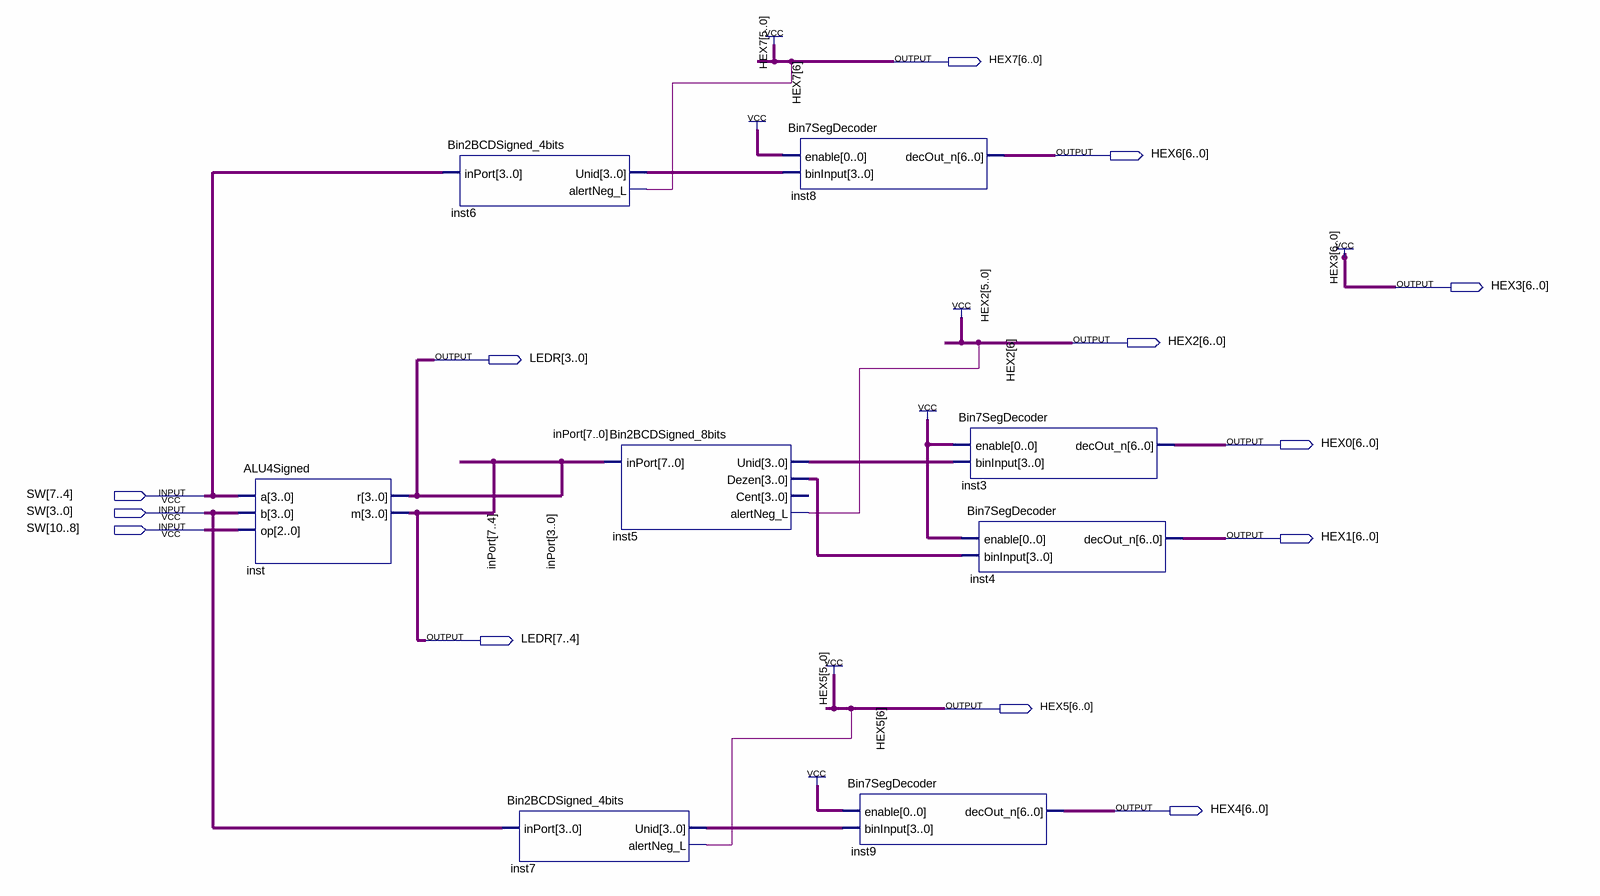
[diagram p0: schematic sheet]
// Quartus schematic ALUDemoSigned.bdf as structural Verilog: 8 symbols, 13 pins
module ALUDemoSigned (
  input  [10:0] SW,
  output [6:0] HEX7,
  output [6:0] HEX6,
  output [6:0] HEX3,
  output [6:0] HEX2,
  output [7:0] LEDR,
  output [6:0] HEX0,
  output [6:0] HEX1,
  output [6:0] HEX5,
  output [6:0] HEX4
);

  wire [3:0] inst5_dezen, inst5_unid, inst6_unid, inst7_unid;

  ALU4Signed inst (.a(SW[7:4]), .b(SW[3:0]), .op(SW[10:8]), .r(LEDR[3:0]), .m(LEDR[7:4]));
  Bin2BCDSigned_4bits inst6 (.inPort(SW[7:4]), .Unid(inst6_unid), .alertNeg_L(HEX7[6]));
  Bin2BCDSigned_4bits inst7 (.inPort(SW[3:0]), .Unid(inst7_unid), .alertNeg_L(HEX5[6]));
  Bin2BCDSigned_8bits inst5 (
    .inPort(LEDR), .Unid(inst5_unid), .Dezen(inst5_dezen), .alertNeg_L(HEX2[6]));  // open: Cent
  Bin7SegDecoder inst8 (.enable(1'b1), .binInput(inst6_unid), .decOut_n(HEX6));
  Bin7SegDecoder inst9 (.enable(1'b1), .binInput(inst7_unid), .decOut_n(HEX4));
  Bin7SegDecoder inst3 (.enable(1'b1), .binInput(inst5_unid), .decOut_n(HEX0));
  Bin7SegDecoder inst4 (.enable(1'b1), .binInput(inst5_dezen), .decOut_n(HEX1));

  assign HEX2[5:0] = {6{1'b1}};
  assign HEX3 = {7{1'b1}};
  assign HEX5[5:0] = {6{1'b1}};
  assign HEX7[5:0] = {6{1'b1}};

  // Other names for the same wires on the sheet: inPort[7:0] = LEDR
endmodule
